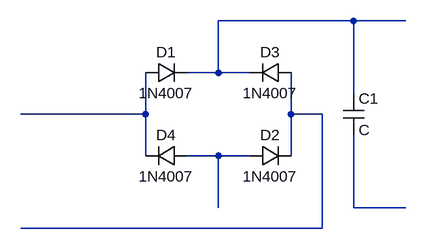
[diagram p0: schematic rectifier.asc]
rectifier.asc, the LTspice schematic file:
Version 4.1
SHEET 1 996 680
WIRE 496 64 288 64
WIRE 576 64 496 64
WIRE 288 144 288 64
WIRE 288 144 240 144
WIRE 336 144 288 144
WIRE 496 176 496 64
WIRE 176 208 176 144
WIRE 176 208 -16 208
WIRE 400 208 400 144
WIRE 448 208 400 208
WIRE 176 272 176 208
WIRE 288 272 240 272
WIRE 336 272 288 272
WIRE 400 272 400 208
WIRE 288 352 288 272
WIRE 496 352 496 240
WIRE 576 352 496 352
WIRE 448 384 448 208
WIRE 448 384 -16 384
SYMBOL diode 176 160 R270
WINDOW 0 32 32 VTop 2
WINDOW 3 0 32 VBottom 2
SYMATTR InstName D1
SYMATTR Value 1N4007
SYMBOL diode 336 288 R270
WINDOW 0 32 32 VTop 2
WINDOW 3 0 32 VBottom 2
SYMATTR InstName D2
SYMATTR Value 1N4007
SYMBOL diode 400 128 R90
WINDOW 0 0 32 VBottom 2
WINDOW 3 32 32 VTop 2
SYMATTR InstName D3
SYMATTR Value 1N4007
SYMBOL diode 240 256 R90
WINDOW 0 0 32 VBottom 2
WINDOW 3 32 32 VTop 2
SYMATTR InstName D4
SYMATTR Value 1N4007
SYMBOL cap 480 176 R0
SYMATTR InstName C1

The netlist it stands for:
* rectifier.asc
D1 N002 N001 1N4007
D2 N004 N003 1N4007
D3 N003 N001 1N4007
D4 N004 N002 1N4007
C1 N001 N005 C
.model D D
.lib standard.dio
.backanno
.end